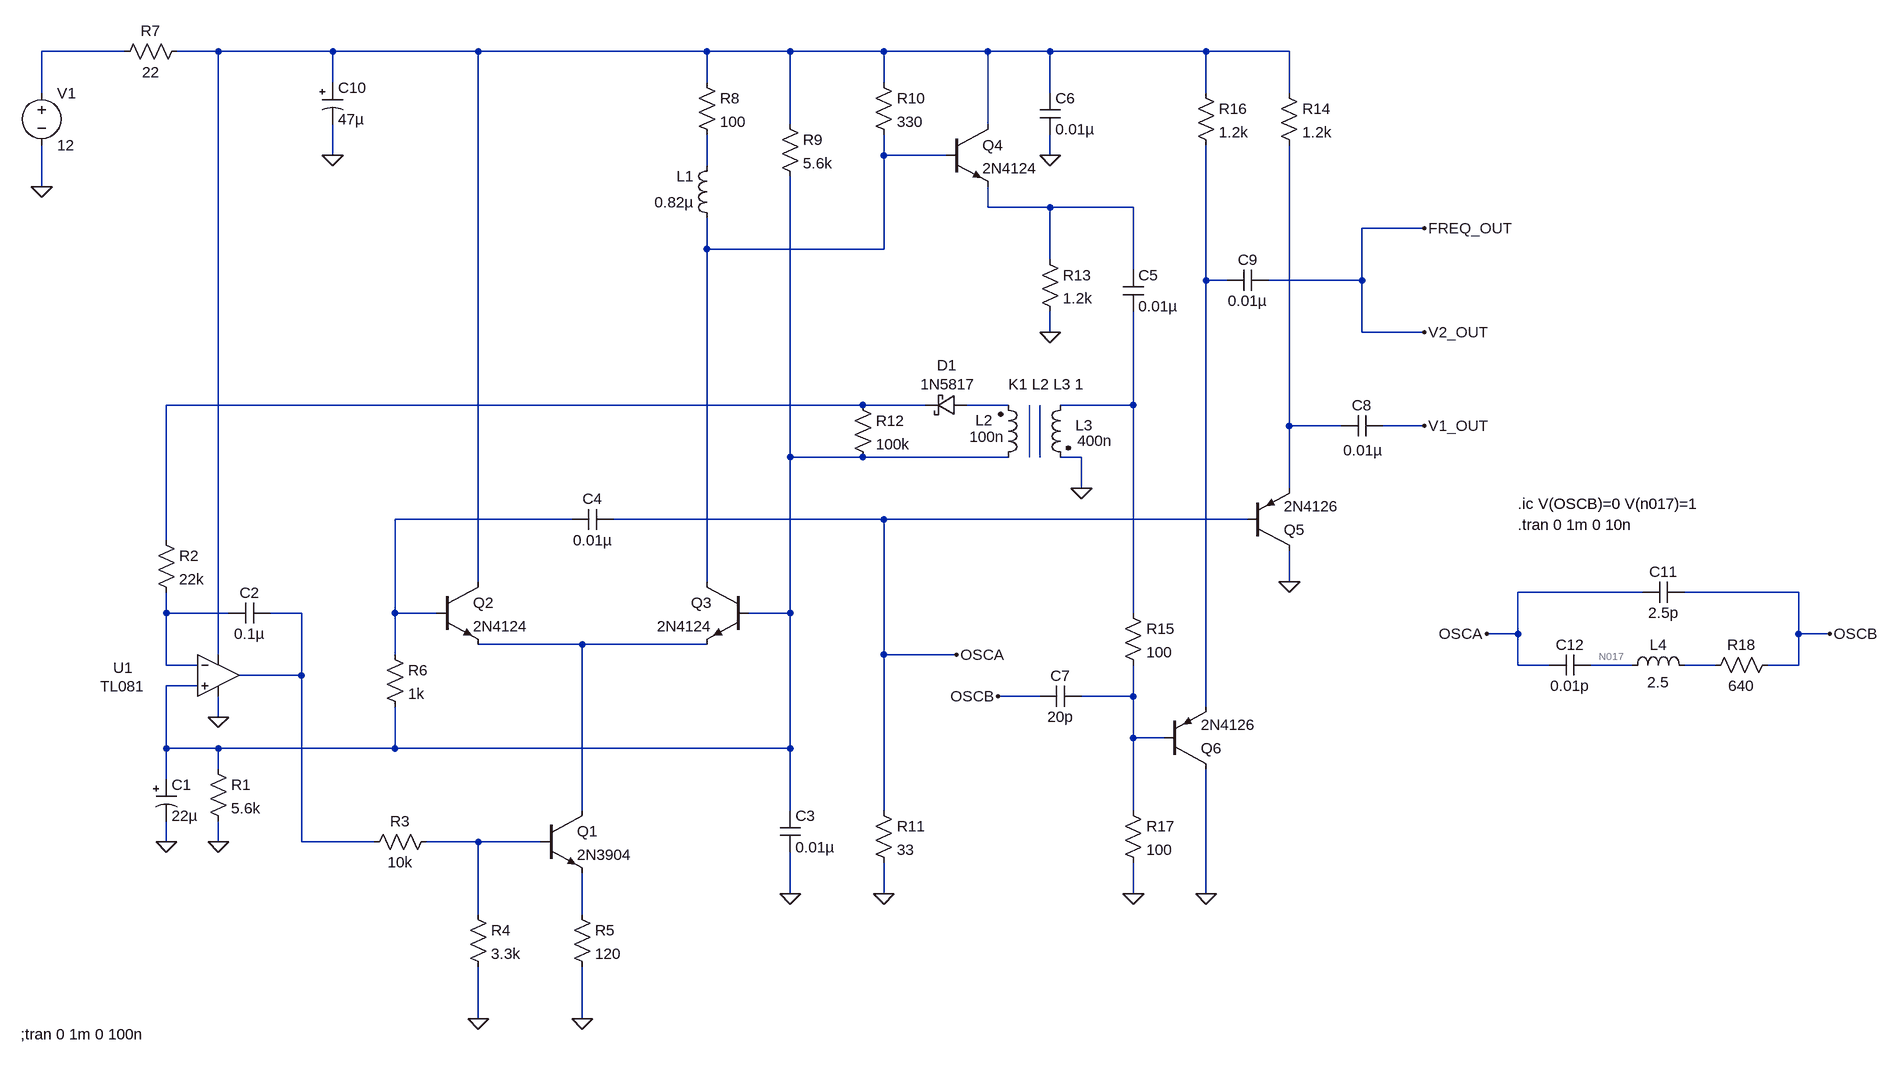
[diagram p0: schematic Crystal_Test_Circuit.asc]
Crystal_Test_Circuit.asc, the LTspice schematic file:
Version 4
SHEET 1 2240 680
WIRE -480 -960 -608 -960
WIRE -336 -960 -400 -960
WIRE -160 -960 -336 -960
WIRE 64 -960 -160 -960
WIRE 416 -960 64 -960
WIRE 544 -960 416 -960
WIRE 688 -960 544 -960
WIRE 848 -960 688 -960
WIRE 944 -960 848 -960
WIRE 1184 -960 944 -960
WIRE 1312 -960 1184 -960
WIRE -160 -912 -160 -960
WIRE 416 -912 416 -960
WIRE 688 -912 688 -960
WIRE -608 -896 -608 -960
WIRE 944 -896 944 -960
WIRE 1184 -896 1184 -960
WIRE 1312 -896 1312 -960
WIRE 544 -848 544 -960
WIRE 848 -848 848 -960
WIRE -160 -800 -160 -848
WIRE 688 -800 688 -832
WIRE 784 -800 688 -800
WIRE 944 -800 944 -832
WIRE 416 -784 416 -832
WIRE -608 -752 -608 -816
WIRE 848 -720 848 -752
WIRE 944 -720 848 -720
WIRE 1072 -720 944 -720
WIRE 1520 -688 1424 -688
WIRE 416 -656 416 -704
WIRE 688 -656 688 -800
WIRE 688 -656 416 -656
WIRE 944 -640 944 -720
WIRE 1072 -624 1072 -720
WIRE 1184 -608 1184 -816
WIRE 1216 -608 1184 -608
WIRE 1424 -608 1424 -688
WIRE 1424 -608 1280 -608
WIRE 944 -528 944 -560
WIRE 1424 -528 1424 -608
WIRE 1520 -528 1424 -528
WIRE 656 -416 -416 -416
WIRE 752 -416 656 -416
WIRE 880 -416 816 -416
WIRE 1072 -416 1072 -560
WIRE 1072 -416 960 -416
WIRE 1312 -384 1312 -816
WIRE 1392 -384 1312 -384
WIRE 1520 -384 1456 -384
WIRE 544 -336 544 -768
WIRE 656 -336 544 -336
WIRE 880 -336 656 -336
WIRE 928 -336 928 -416
WIRE 992 -336 960 -336
WIRE 992 -288 992 -336
WIRE 1312 -288 1312 -384
WIRE 208 -240 -64 -240
WIRE 688 -240 272 -240
WIRE 1248 -240 688 -240
WIRE -416 -208 -416 -416
WIRE 64 -144 64 -960
WIRE 416 -144 416 -656
WIRE 1312 -144 1312 -192
WIRE 1856 -128 1664 -128
WIRE 2096 -128 1920 -128
WIRE -416 -96 -416 -128
WIRE -320 -96 -416 -96
WIRE -208 -96 -256 -96
WIRE -64 -96 -64 -240
WIRE 0 -96 -64 -96
WIRE 544 -96 544 -336
WIRE 544 -96 480 -96
WIRE 1072 -96 1072 -416
WIRE 1664 -64 1664 -128
WIRE 1664 -64 1616 -64
WIRE 2096 -64 2096 -128
WIRE 2144 -64 2096 -64
WIRE 224 -48 64 -48
WIRE 416 -48 224 -48
WIRE -336 -32 -336 -960
WIRE -64 -32 -64 -96
WIRE 688 -32 688 -240
WIRE 800 -32 688 -32
WIRE -416 -16 -416 -96
WIRE -368 -16 -416 -16
WIRE 1664 -16 1664 -64
WIRE 1712 -16 1664 -16
WIRE 1840 -16 1776 -16
WIRE 1968 -16 1920 -16
WIRE 2096 -16 2096 -64
WIRE 2096 -16 2048 -16
WIRE -208 0 -208 -96
WIRE -208 0 -304 0
WIRE -368 16 -416 16
WIRE 928 32 864 32
WIRE 1072 32 1072 -16
WIRE 1072 32 992 32
WIRE 1184 48 1184 -608
WIRE -336 64 -336 32
WIRE 1072 96 1072 32
WIRE 1120 96 1072 96
WIRE -416 112 -416 16
WIRE -336 112 -416 112
WIRE -64 112 -64 48
WIRE -64 112 -336 112
WIRE 544 112 544 -96
WIRE 544 112 -64 112
WIRE -336 144 -336 112
WIRE -416 160 -416 112
WIRE 224 208 224 -48
WIRE 544 208 544 112
WIRE 688 208 688 -32
WIRE 1072 208 1072 96
WIRE -416 256 -416 224
WIRE -336 256 -336 224
WIRE -208 256 -208 0
WIRE -96 256 -208 256
WIRE 64 256 -16 256
WIRE 160 256 64 256
WIRE 544 336 544 272
WIRE 688 336 688 288
WIRE 1072 336 1072 288
WIRE 1184 336 1184 144
WIRE 64 368 64 256
WIRE 224 368 224 304
WIRE 64 528 64 448
WIRE 224 528 224 448
FLAG -336 64 0
FLAG -416 256 0
FLAG -336 256 0
FLAG 224 528 0
FLAG 64 528 0
FLAG 544 336 0
FLAG 688 336 0
FLAG 992 -288 0
FLAG 944 -528 0
FLAG 944 -800 0
FLAG 1312 -144 0
FLAG 1072 336 0
FLAG 1184 336 0
FLAG 1520 -688 FREQ_OUT
FLAG 1520 -528 V2_OUT
FLAG 1520 -384 V1_OUT
FLAG -160 -800 0
FLAG -608 -752 0
FLAG 1616 -64 OSCA
FLAG 2144 -64 OSCB
FLAG 800 -32 OSCA
FLAG 864 32 OSCB
SYMBOL AutoGenerated\\TL081 -336 0 R0
WINDOW 0 -162 -12 Left 2
WINDOW 3 -147 1 Top 2
SYMATTR InstName U1
SYMBOL polcap -432 160 R0
SYMATTR InstName C1
SYMATTR Value 22µ
SYMBOL res -352 128 R0
SYMATTR InstName R1
SYMATTR Value 5.6k
SYMBOL res -432 -224 R0
SYMATTR InstName R2
SYMATTR Value 22k
SYMBOL cap -256 -112 R90
WINDOW 0 0 32 VBottom 2
WINDOW 3 32 32 VTop 2
SYMATTR InstName C2
SYMATTR Value 0.1µ
SYMBOL res 0 240 R90
WINDOW 0 0 56 VBottom 2
WINDOW 3 32 56 VTop 2
SYMATTR InstName R3
SYMATTR Value 10k
SYMBOL res 48 352 R0
SYMATTR InstName R4
SYMATTR Value 3.3k
SYMBOL npn 160 208 R0
SYMATTR InstName Q1
SYMATTR Value 2N3904
SYMBOL res 208 352 R0
SYMATTR InstName R5
SYMATTR Value 120
SYMBOL res -80 -48 R0
SYMATTR InstName R6
SYMATTR Value 1k
SYMBOL npn 0 -144 R0
SYMATTR InstName Q2
SYMATTR Value 2N4124
SYMBOL npn 480 -144 M0
SYMATTR InstName Q3
SYMATTR Value 2N4124
SYMBOL cap 528 208 R0
SYMATTR InstName C3
SYMATTR Value 0.01µ
SYMBOL res -384 -976 R90
WINDOW 0 0 56 VBottom 2
WINDOW 3 32 56 VTop 2
SYMATTR InstName R7
SYMATTR Value 22
SYMBOL res 400 -928 R0
SYMATTR InstName R8
SYMATTR Value 100
SYMBOL ind 432 -688 R180
WINDOW 0 36 80 Left 2
WINDOW 3 36 40 Left 2
SYMATTR InstName L1
SYMATTR Value 0.82µ
SYMBOL res 528 -864 R0
SYMATTR InstName R9
SYMATTR Value 5.6k
SYMBOL res 672 -928 R0
SYMATTR InstName R10
SYMATTR Value 330
SYMBOL npn 784 -848 R0
SYMATTR InstName Q4
SYMATTR Value 2N4124
SYMBOL cap 272 -256 R90
WINDOW 0 0 32 VBottom 2
WINDOW 3 32 32 VTop 2
SYMATTR InstName C4
SYMATTR Value 0.01µ
SYMBOL res 672 192 R0
SYMATTR InstName R11
SYMATTR Value 33
SYMBOL ind2 864 -320 M180
WINDOW 0 -35 73 Left 2
WINDOW 3 -44 47 Left 2
SYMATTR InstName L2
SYMATTR Value 100n
SYMATTR Type ind
SYMBOL ind2 976 -432 M0
WINDOW 0 -34 47 Left 2
WINDOW 3 -64 71 Left 2
SYMATTR InstName L3
SYMATTR Value 400n
SYMATTR Type ind
SYMBOL res 640 -432 R0
SYMATTR InstName R12
SYMATTR Value 100k
SYMBOL schottky 816 -432 R90
WINDOW 0 -30 31 VBottom 2
WINDOW 3 -32 29 VTop 2
SYMATTR InstName D1
SYMATTR Value 1N5817
SYMATTR Description Diode
SYMATTR Type diode
SYMBOL cap 1056 -624 R0
SYMATTR InstName C5
SYMATTR Value 0.01µ
SYMBOL res 928 -656 R0
SYMATTR InstName R13
SYMATTR Value 1.2k
SYMBOL cap 928 -896 R0
SYMATTR InstName C6
SYMATTR Value 0.01µ
SYMBOL res 1296 -912 R0
SYMATTR InstName R14
SYMATTR Value 1.2k
SYMBOL pnp 1248 -192 M180
SYMATTR InstName Q5
SYMATTR Value 2N4126
SYMBOL res 1056 -112 R0
SYMATTR InstName R15
SYMATTR Value 100
SYMBOL cap 992 16 R90
WINDOW 0 0 32 VBottom 2
WINDOW 3 32 32 VTop 2
SYMATTR InstName C7
SYMATTR Value 20p
SYMBOL res 1168 -912 R0
SYMATTR InstName R16
SYMATTR Value 1.2k
SYMBOL pnp 1120 144 M180
SYMATTR InstName Q6
SYMATTR Value 2N4126
SYMBOL res 1056 192 R0
SYMATTR InstName R17
SYMATTR Value 100
SYMBOL cap 1456 -400 R90
WINDOW 0 0 32 VBottom 2
WINDOW 3 38 30 VTop 2
SYMATTR InstName C8
SYMATTR Value 0.01µ
SYMBOL cap 1280 -624 R90
WINDOW 0 0 32 VBottom 2
WINDOW 3 32 32 VTop 2
SYMATTR InstName C9
SYMATTR Value 0.01µ
SYMBOL polcap -176 -912 R0
SYMATTR InstName C10
SYMATTR Value 47µ
SYMBOL voltage -608 -912 R0
WINDOW 123 0 0 Left 0
WINDOW 39 0 0 Left 0
SYMATTR InstName V1
SYMATTR Value 12
SYMBOL res 2064 -32 R90
WINDOW 0 0 56 VBottom 2
WINDOW 3 32 56 VTop 2
SYMATTR InstName R18
SYMATTR Value 640
SYMBOL cap 1776 -32 R90
WINDOW 0 0 32 VBottom 2
WINDOW 3 32 32 VTop 2
SYMATTR InstName C12
SYMATTR Value 0.01p
SYMBOL ind 1824 0 R270
WINDOW 0 32 56 VTop 2
WINDOW 3 5 56 VBottom 2
SYMATTR InstName L4
SYMATTR Value 2.5
SYMBOL cap 1920 -144 R90
WINDOW 0 0 32 VBottom 2
WINDOW 3 32 32 VTop 2
SYMATTR InstName C11
SYMATTR Value 2.5p
TEXT 880 -448 Left 2 !K1 L2 L3 1
TEXT -640 552 Left 2 !;tran 0 1m 0 100n
TEXT 1664 -264 Left 2 !.ic V(OSCB)=0 V(n017)=1
TEXT 1664 -232 Left 2 !.tran 0 1m 0 10n
LINE Normal 912 -336 912 -416
LINE Normal 912 -336 912 -336 2
LINE Normal 912 -336 912 -336 2
LINE Normal 912 -336 912 -336 2
LINE Normal 912 -336 912 -336 2

The netlist it stands for:
* Crystal_Test_Circuit.asc
* U1: TL081 (symbol AutoGenerated\TL081 not available, pins judged from their places): In+=N011 In-=N014 V+=N002 V-=0 OUT=N015
C1 N011 0 22µ
R1 N011 0 5.6k
R2 N007 N014 22k
C2 N015 N014 0.1µ
R3 N020 N015 10k
R4 N020 0 3.3k
Q1 N016 N020 N021 0 2N3904
R5 N021 0 120
R6 N013 N011 1k
Q2 N002 N013 N016 0 2N4124
Q3 N003 N011 N016 0 2N4124
C3 N011 0 0.01µ
R7 N002 N001 22
R8 N002 N004 100
L1 N003 N004 0.82µ
R9 N002 N011 5.6k
R10 N002 N003 330
Q4 N002 N003 N005 0 2N4124
C4 OSCA N013 0.01µ
R11 OSCA 0 33
L2 N011 N008 100n
L3 N009 0 400n
R12 N007 N011 100k
D1 N008 N007 1N5817
C5 N005 N009 0.01µ
R13 N005 0 1.2k
C6 N002 0 0.01µ
R14 N002 N010 1.2k
Q5 0 OSCA N010 0 2N4126
R15 N009 N019 100
C7 N019 OSCB 20p
R16 N002 N006 1.2k
Q6 0 N019 N006 0 2N4126
R17 N019 0 100
C8 V1_OUT N010 0.01µ
C9 V2_OUT N006 0.01µ
C10 N002 0 47µ
V1 N001 0 12
R18 OSCB N018 640
C12 N017 OSCA 0.01p
L4 N017 N018 2.5
C11 OSCB OSCA 2.5p
.model D D
.lib standard.dio
.model NPN NPN
.model PNP PNP
.lib standard.bjt
K1 L2 L3 1
;tran 0 1m 0 100n
.ic V(OSCB)=0 V(n017)=1
.tran 0 1m 0 10n
.backanno
.end